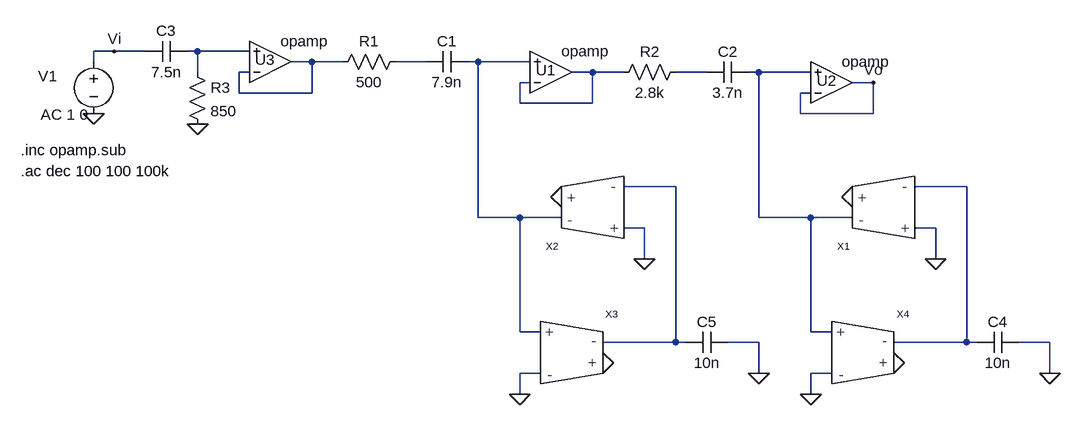
[diagram p0: schematic Ej_6b.asc]
Ej_6b.asc, the LTspice schematic file:
Version 4
SHEET 1 1092 716
WIRE -368 112 -400 112
WIRE -320 112 -368 112
WIRE -240 112 -256 112
WIRE -160 112 -240 112
WIRE -400 128 -400 112
WIRE -64 128 -96 128
WIRE -16 128 -64 128
WIRE 112 128 64 128
WIRE 192 128 176 128
WIRE 272 128 192 128
WIRE -240 144 -240 112
WIRE -160 144 -176 144
WIRE 368 144 336 144
WIRE 416 144 368 144
WIRE 544 144 496 144
WIRE 624 144 608 144
WIRE 704 144 624 144
WIRE 272 160 256 160
WIRE 800 160 768 160
WIRE -176 176 -176 144
WIRE -64 176 -64 128
WIRE -64 176 -176 176
WIRE 704 176 688 176
WIRE 256 192 256 160
WIRE 368 192 368 144
WIRE 368 192 256 192
WIRE 688 208 688 176
WIRE 800 208 800 160
WIRE 800 208 688 208
WIRE 496 320 416 320
WIRE 944 320 864 320
WIRE 192 368 192 128
WIRE 256 368 192 368
WIRE 320 368 256 368
WIRE 624 368 624 144
WIRE 704 368 624 368
WIRE 768 368 704 368
WIRE 448 384 416 384
WIRE 896 384 864 384
WIRE 448 432 448 384
WIRE 896 432 896 384
WIRE 256 544 256 368
WIRE 288 544 256 544
WIRE 704 544 704 368
WIRE 736 544 704 544
WIRE 496 560 496 320
WIRE 496 560 384 560
WIRE 512 560 496 560
WIRE 624 560 576 560
WIRE 944 560 944 320
WIRE 944 560 832 560
WIRE 960 560 944 560
WIRE 1072 560 1024 560
WIRE 288 608 256 608
WIRE 624 608 624 560
WIRE 736 608 704 608
WIRE 1072 608 1072 560
WIRE 256 640 256 608
WIRE 704 640 704 608
FLAG -368 112 Vi
FLAG 800 160 Vo
FLAG -400 208 0
FLAG 256 640 0
FLAG 624 608 0
FLAG -240 224 0
FLAG 448 432 0
FLAG 320 336 0
FLAG 384 592 0
FLAG 704 640 0
FLAG 1072 608 0
FLAG 896 432 0
FLAG 768 336 0
FLAG 832 592 0
SYMBOL res 80 112 R90
WINDOW 0 0 56 VBottom 2
WINDOW 3 32 56 VTop 2
SYMATTR InstName R1
SYMATTR Value 500
SYMBOL cap 176 112 R90
WINDOW 0 0 32 VBottom 2
WINDOW 3 32 32 VTop 2
SYMATTR InstName C1
SYMATTR Value 7.9n
SYMBOL OpAmps\\opamp 304 208 M180
WINDOW 0 -23 67 Left 2
SYMATTR InstName U1
SYMBOL res 512 128 R90
WINDOW 0 0 56 VBottom 2
WINDOW 3 32 56 VTop 2
SYMATTR InstName R2
SYMATTR Value 2.8k
SYMBOL cap 608 128 R90
WINDOW 0 0 32 VBottom 2
WINDOW 3 32 32 VTop 2
SYMATTR InstName C2
SYMATTR Value 3.7n
SYMBOL OpAmps\\opamp 736 224 M180
WINDOW 0 -23 67 Left 2
SYMATTR InstName U2
SYMBOL cap -256 96 R90
WINDOW 0 0 32 VBottom 2
WINDOW 3 32 32 VTop 2
SYMATTR InstName C3
SYMATTR Value 7.5n
SYMBOL OpAmps\\opamp -128 192 M180
WINDOW 0 -23 67 Left 2
SYMATTR InstName U3
SYMBOL voltage -400 112 R0
WINDOW 0 -85 38 Left 2
WINDOW 3 -81 69 Left 2
WINDOW 123 -81 97 Left 2
WINDOW 39 0 0 Left 0
SYMATTR InstName V1
SYMATTR Value ""
SYMATTR Value2 AC 1 0
SYMBOL cap 576 544 R90
WINDOW 0 0 32 VBottom 2
WINDOW 3 32 32 VTop 2
SYMATTR InstName C5
SYMATTR Value 10n
SYMBOL res -256 128 R0
SYMATTR InstName R3
SYMATTR Value 850
SYMBOL OTAdif 336 352 R180
SYMATTR InstName X2
SYMATTR SpiceLine gm=525u
SYMBOL OTAdif 368 576 R0
SYMATTR InstName X3
SYMATTR SpiceLine gm=525u
SYMBOL cap 1024 544 R90
WINDOW 0 0 32 VBottom 2
WINDOW 3 32 32 VTop 2
SYMATTR InstName C4
SYMATTR Value 10n
SYMBOL OTAdif 784 352 R180
SYMATTR InstName X1
SYMATTR SpiceLine gm=525u
SYMBOL OTAdif 816 576 R0
SYMATTR InstName X4
SYMATTR SpiceLine gm=525u
TEXT -512 264 Left 2 !.inc opamp.sub
TEXT -512 296 Left 2 !.ac dec 100 100 100k

The netlist it stands for:
* Ej_6b.asc
R1 N003 N002 500
C1 N004 N003 7.9n
XU1 N005 N004 N005 opamp Aol=100K GBW=10Meg  ; pins invin noninvin out
R2 N006 N005 2.8k
C2 N007 N006 3.7n
XU2 Vo N007 Vo opamp Aol=100K GBW=10Meg  ; pins invin noninvin out
C3 N001 Vi 7.5n
XU3 N002 N001 N002 opamp Aol=100K GBW=10Meg  ; pins invin noninvin out
V1 Vi 0 AC 1 0
C5 0 N008 10n
R3 N001 0 850
XX2 0 N008 N004 0 OTAdif params: gm=525u  ; pins V+ V- Io- Io+
XX3 N004 0 N008 0 OTAdif params: gm=525u  ; pins V+ V- Io- Io+
C4 0 N009 10n
XX1 0 N009 N007 0 OTAdif params: gm=525u  ; pins V+ V- Io- Io+
XX4 N007 0 N009 0 OTAdif params: gm=525u  ; pins V+ V- Io- Io+
.inc opamp.sub
.ac dec 100 100 100k
.backanno
.end